# Altium schematic sheet SIRA_Rev1.SchDoc
size A3
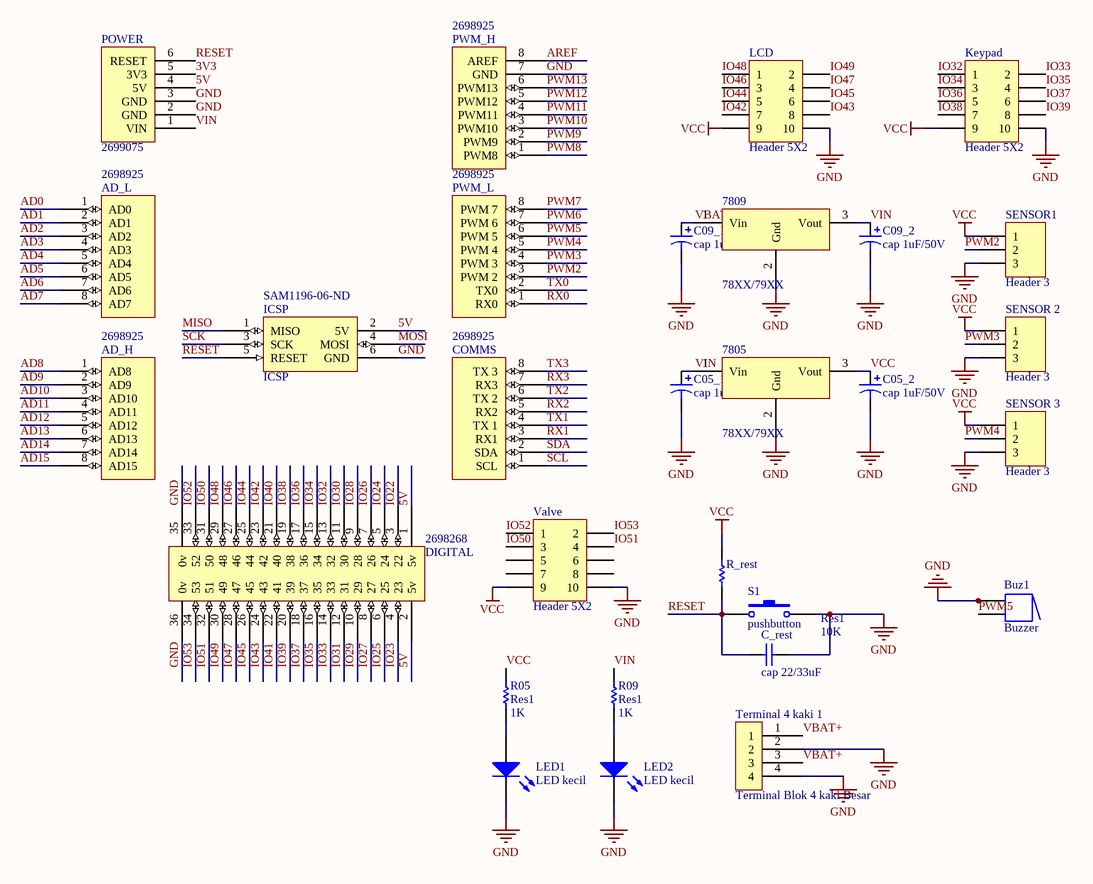
[diagram p0: SIRA_Rev1.SchDoc]

## Parts
7805  78XX/79XX  [78XX/79XX]
7809  78XX/79XX  [78XX/79XX]
AD_H  Supplier Part Number 4: 2698925  [Header 8x1 8.5mm]  (hidden comment: AD_H)
AD_L  Supplier Part Number 5: 2698925  [Header 8x1 8.5mm]  (hidden comment: AD_L)
Buz1  Buzzer  [ABSM-1574]
C05_1  cap 1uF/50V  [cap 1uF/50V]
C05_2  cap 1uF/50V  [cap 1uF/50V]
C09_1  cap 1uF/50V  [cap 1uF/50V]
C09_2  cap 1uF/50V  [cap 1uF/50V]
C_rest  cap 22/33uF  [cap 22/33uF]
COMMS  Supplier Part Number 4: 2698925  [Header 8x1 8.5mm]  (hidden comment: Communication)
DIGITAL  Supplier Part Number 5: 2698268  [HEADER 36X 8MM]  (hidden comment: IO_36)
ICSP  ICSP  Supplier Part Number 5: SAM1196-06-ND  [ICSP]
Keypad  Header 5X2  [HDR2X5]
LCD  Header 5X2  [HDR2X5]
LED1  LED kecil  [LED kecil]
LED2  LED kecil  [LED kecil]
POWER  Supplier Part Number 2: 2699075  [Header 6x1 8.5mm]  (hidden comment: POWER)
PWM_H  Supplier Part Number 4: 2698925  [Header 8x1 8.5mm]  (hidden comment: PWM_H)
PWM_L  Supplier Part Number 4: 2698925  [Header 8x1 8.5mm]  (hidden comment: PWM_L)
R05  Res1  value 1K  [AXIAL-0.3]
R09  Res1  value 1K  [AXIAL-0.3]
R_rest  Res1  value 10K  [AXIAL-0.3]
S1  pushbutton  [pushbutton]
SENSOR1  Header 3  [HDR1X3]
SENSOR_2  Header 3  [HDR1X3]
SENSOR_3  Header 3  [HDR1X3]
Terminal_4_kaki_1  Terminal Blok 4 kaki Besar  [TERMINAL 4 KAKI]
Valve  Header 5X2  [HDR2X5]

## Nets
GND: 7805.2(Gnd) 7809.2(Gnd) Buz1.1 Buz1.1A C05_1.2 C05_2.2 C09_1.2 C09_2.2 C_rest.1 DIGITAL.35(0v) DIGITAL.36(0v) ICSP.6(GND) Keypad.10 LCD.10 LED1.2(K) LED2.2(K) POWER.2(GND) POWER.3(GND) PWM_H.7(GND) S1.2 SENSOR1.3 SENSOR_2.3 SENSOR_3.3 Terminal_4_kaki_1.2 Terminal_4_kaki_1.4 Valve.10
VCC: 7805.3(Vout) C05_2.1 Keypad.9 LCD.9 R05.2 R_rest.2 SENSOR1.1 SENSOR_2.1 SENSOR_3.1 Valve.9
3V3: POWER.5(3V3)
5V: DIGITAL.1(5v) DIGITAL.2(5v) ICSP.2(5V) POWER.4(5V)
AD0: AD_L.1(AD0)
AD1: AD_L.2(AD1)
AD2: AD_L.3(AD2)
AD3: AD_L.4(AD3)
AD4: AD_L.5(AD4)
AD5: AD_L.6(AD5)
AD6: AD_L.7(AD6)
AD7: AD_L.8(AD7)
AD8: AD_H.1(AD8)
AD9: AD_H.2(AD9)
AD10: AD_H.3(AD10)
AD11: AD_H.4(AD11)
AD12: AD_H.5(AD12)
AD13: AD_H.6(AD13)
AD14: AD_H.7(AD14)
AD15: AD_H.8(AD15)
AREF: PWM_H.8(AREF)
IO22: DIGITAL.3(22)
IO23: DIGITAL.4(23)
IO24: DIGITAL.5(24)
IO25: DIGITAL.6(25)
IO26: DIGITAL.7(26)
IO27: DIGITAL.8(27)
IO28: DIGITAL.9(28)
IO29: DIGITAL.10(29)
IO30: DIGITAL.11(30)
IO31: DIGITAL.12(31)
IO32: DIGITAL.13(32) Keypad.1
IO33: DIGITAL.14(33) Keypad.2
IO34: DIGITAL.15(34) Keypad.3
IO35: DIGITAL.16(35) Keypad.4
IO36: DIGITAL.17(36) Keypad.5
IO37: DIGITAL.18(37) Keypad.6
IO38: DIGITAL.19(38) Keypad.7
IO39: DIGITAL.20(39) Keypad.8
IO40: DIGITAL.21(40)
IO41: DIGITAL.22(41)
IO42: DIGITAL.23(42) LCD.7
IO43: DIGITAL.24(43) LCD.8
IO44: DIGITAL.25(44) LCD.5
IO45: DIGITAL.26(45) LCD.6
IO46: DIGITAL.27(46) LCD.3
IO47: DIGITAL.28(47) LCD.4
IO48: DIGITAL.29(48) LCD.1
IO49: DIGITAL.30(49) LCD.2
IO50: DIGITAL.31(50) Valve.3
IO51: DIGITAL.32(51) Valve.4
IO52: DIGITAL.33(52) Valve.1
IO53: DIGITAL.34(53) Valve.2
MISO: ICSP.1(MISO)
MOSI: ICSP.4(MOSI)
PWM2: PWM_L.3(PWM_2) SENSOR1.2
PWM3: PWM_L.4(PWM_3) SENSOR_2.2
PWM4: PWM_L.5(PWM_4) SENSOR_3.2
PWM5: Buz1.2 Buz1.2A PWM_L.6(PWM_5)
PWM6: PWM_L.7(PWM_6)
PWM7: PWM_L.8(PWM_7)
PWM8: PWM_H.1(PWM8)
PWM9: PWM_H.2(PWM9)
PWM10: PWM_H.3(PWM10)
PWM11: PWM_H.4(PWM11)
PWM12: PWM_H.5(PWM12)
PWM13: PWM_H.6(PWM13)
RESET: C_rest.2 ICSP.5(RESET) POWER.6(RESET) R_rest.1 S1.1
RX0: PWM_L.1(RX0)
RX1: COMMS.3(RX1)
RX2: COMMS.5(RX2)
RX3: COMMS.7(RX3)
SCK: ICSP.3(SCK)
SCL: COMMS.1(SCL)
SDA: COMMS.2(SDA)
TX0: PWM_L.2(TX0)
TX1: COMMS.4(TX_1)
TX2: COMMS.6(TX_2)
TX3: COMMS.8(TX_3)
VBAT+: 7809.1(Vin) C09_1.1 Terminal_4_kaki_1.1 Terminal_4_kaki_1.3
VIN: 7805.1(Vin) 7809.3(Vout) C05_1.1 C09_2.1 POWER.1(VIN) R09.2
NetLED1_1: LED1.1(A) R05.1
NetLED2_1: LED2.1(A) R09.1

Not connected (* = marked no-connect by the designer): Valve 5 6 7 8

## Notes on the sheet
- Title
- Size:
- Date:
- A3
- Number:
- Time:
- Revision:
- Sheet
- of
- File:

## Library data of the parts
7805 7809 = 7805/7809/7812/7905/7909/7912
Buz1 = Buzzer: Magnetic Transducer Buzzer; Published: 24-Mar-1999; LatestRevisionDate: 17-Dec-2003; LatestRevisionNote: Schematic revised, PCB Footprint replaced.; DatasheetVersion: 17-Dec-2003; PackageReference: ABSM-1574; Publisher: Altium Limited; PackageDescription: Magnetic Transducer Buzzer; ComponentLink1Description: Manufacturer Link; ComponentLink1URL: http://www.megastar.com/linecard/buzzmode/index.php
Keypad LCD Valve = Header 5X2: Header, 5-Pin, Dual row; LatestRevisionDate: 17-Jul-2002; LatestRevisionNote: Re-released for DXP Platform.; Publisher: Altium Limited
R05 R09 R_rest = Res1: Resistor; Published: 8-Jun-2000; LatestRevisionDate: 17-Jul-2002; LatestRevisionNote: Re-released for DXP Platform.; PackageReference: AXIAL-0.3; Publisher: Altium Limited; PackageDescription: Axial Device, Thru-Hole; 2 Leads; 0.3 in Pin Spacing
SENSOR1 SENSOR_2 SENSOR_3 = Header 3: Header, 3-Pin; LatestRevisionDate: 17-Jul-2002; LatestRevisionNote: Re-released for DXP Platform.; Publisher: Altium Limited
Terminal_4_kaki_1 = Terminal Blok 4 kaki
AD_H = AD_H: Supplier 1: Arrow; Supplier Part Number 1: 2698940; Supplier 2: Arrow; Supplier Part Number 2: 2698939; Supplier 3: Digi-Key; Supplier Part Number 3: SAM1198-08-ND; Supplier 4: Arrow
AD_L = AD_L: Supplier 1: Digi-Key; Supplier Part Number 1: SAM1198-08-ND; Supplier 2: Arrow; Supplier Part Number 2: 2698939; Supplier 3: Arrow; Supplier Part Number 3: 2698940; Supplier 4: Arrow; Supplier Part Number 4: 43085273; Supplier 5: Arrow
COMMS = Communication: Supplier 1: Digi-Key; Supplier Part Number 1: SAM1198-08-ND; Supplier 2: Arrow; Supplier Part Number 2: 2698940; Supplier 3: Arrow; Supplier Part Number 3: 2698939; Supplier 4: Arrow
DIGITAL = IO_36: Supplier 1: Digi-Key; Supplier Part Number 1: SAM1196-18-ND; Supplier 2: Arrow; Supplier Part Number 2: 48117090; Supplier 3: Arrow; Supplier Part Number 3: 46093326; Supplier 4: Arrow; Supplier Part Number 4: 2698278; Supplier 5: Arrow
ICSP = ICSP: Supplier 1: Digi-Key; Supplier Part Number 1: SAM1185-06-ND; Supplier 2: Arrow; Supplier Part Number 2: 2699117; Supplier 3: Arrow; Supplier Part Number 3: 43862781; Supplier 4: Arrow; Supplier Part Number 4: 2699091; Supplier 5: Digi-Key
POWER = POWER: Supplier 1: Arrow; Supplier Part Number 1: 52553843; Supplier 2: Arrow; Supplier 3: Digi-Key; Supplier Part Number 3: SAM1198-06-ND; Supplier 4: Arrow; Supplier Part Number 4: 2699089; Supplier 5: Arrow; Supplier Part Number 5: 2699088
PWM_H = PWM_H: Supplier 1: Digi-Key; Supplier Part Number 1: SAM1198-08-ND; Supplier 2: Arrow; Supplier Part Number 2: 2698940; Supplier 3: Arrow; Supplier Part Number 3: 2698939; Supplier 4: Arrow
PWM_L = PWM_L: Supplier 1: Arrow; Supplier Part Number 1: 2698940; Supplier 2: Arrow; Supplier Part Number 2: 2698939; Supplier 3: Digi-Key; Supplier Part Number 3: SAM1198-08-ND; Supplier 4: Arrow